# Altium project Sampler.PrjPCB (part 1 of 5)
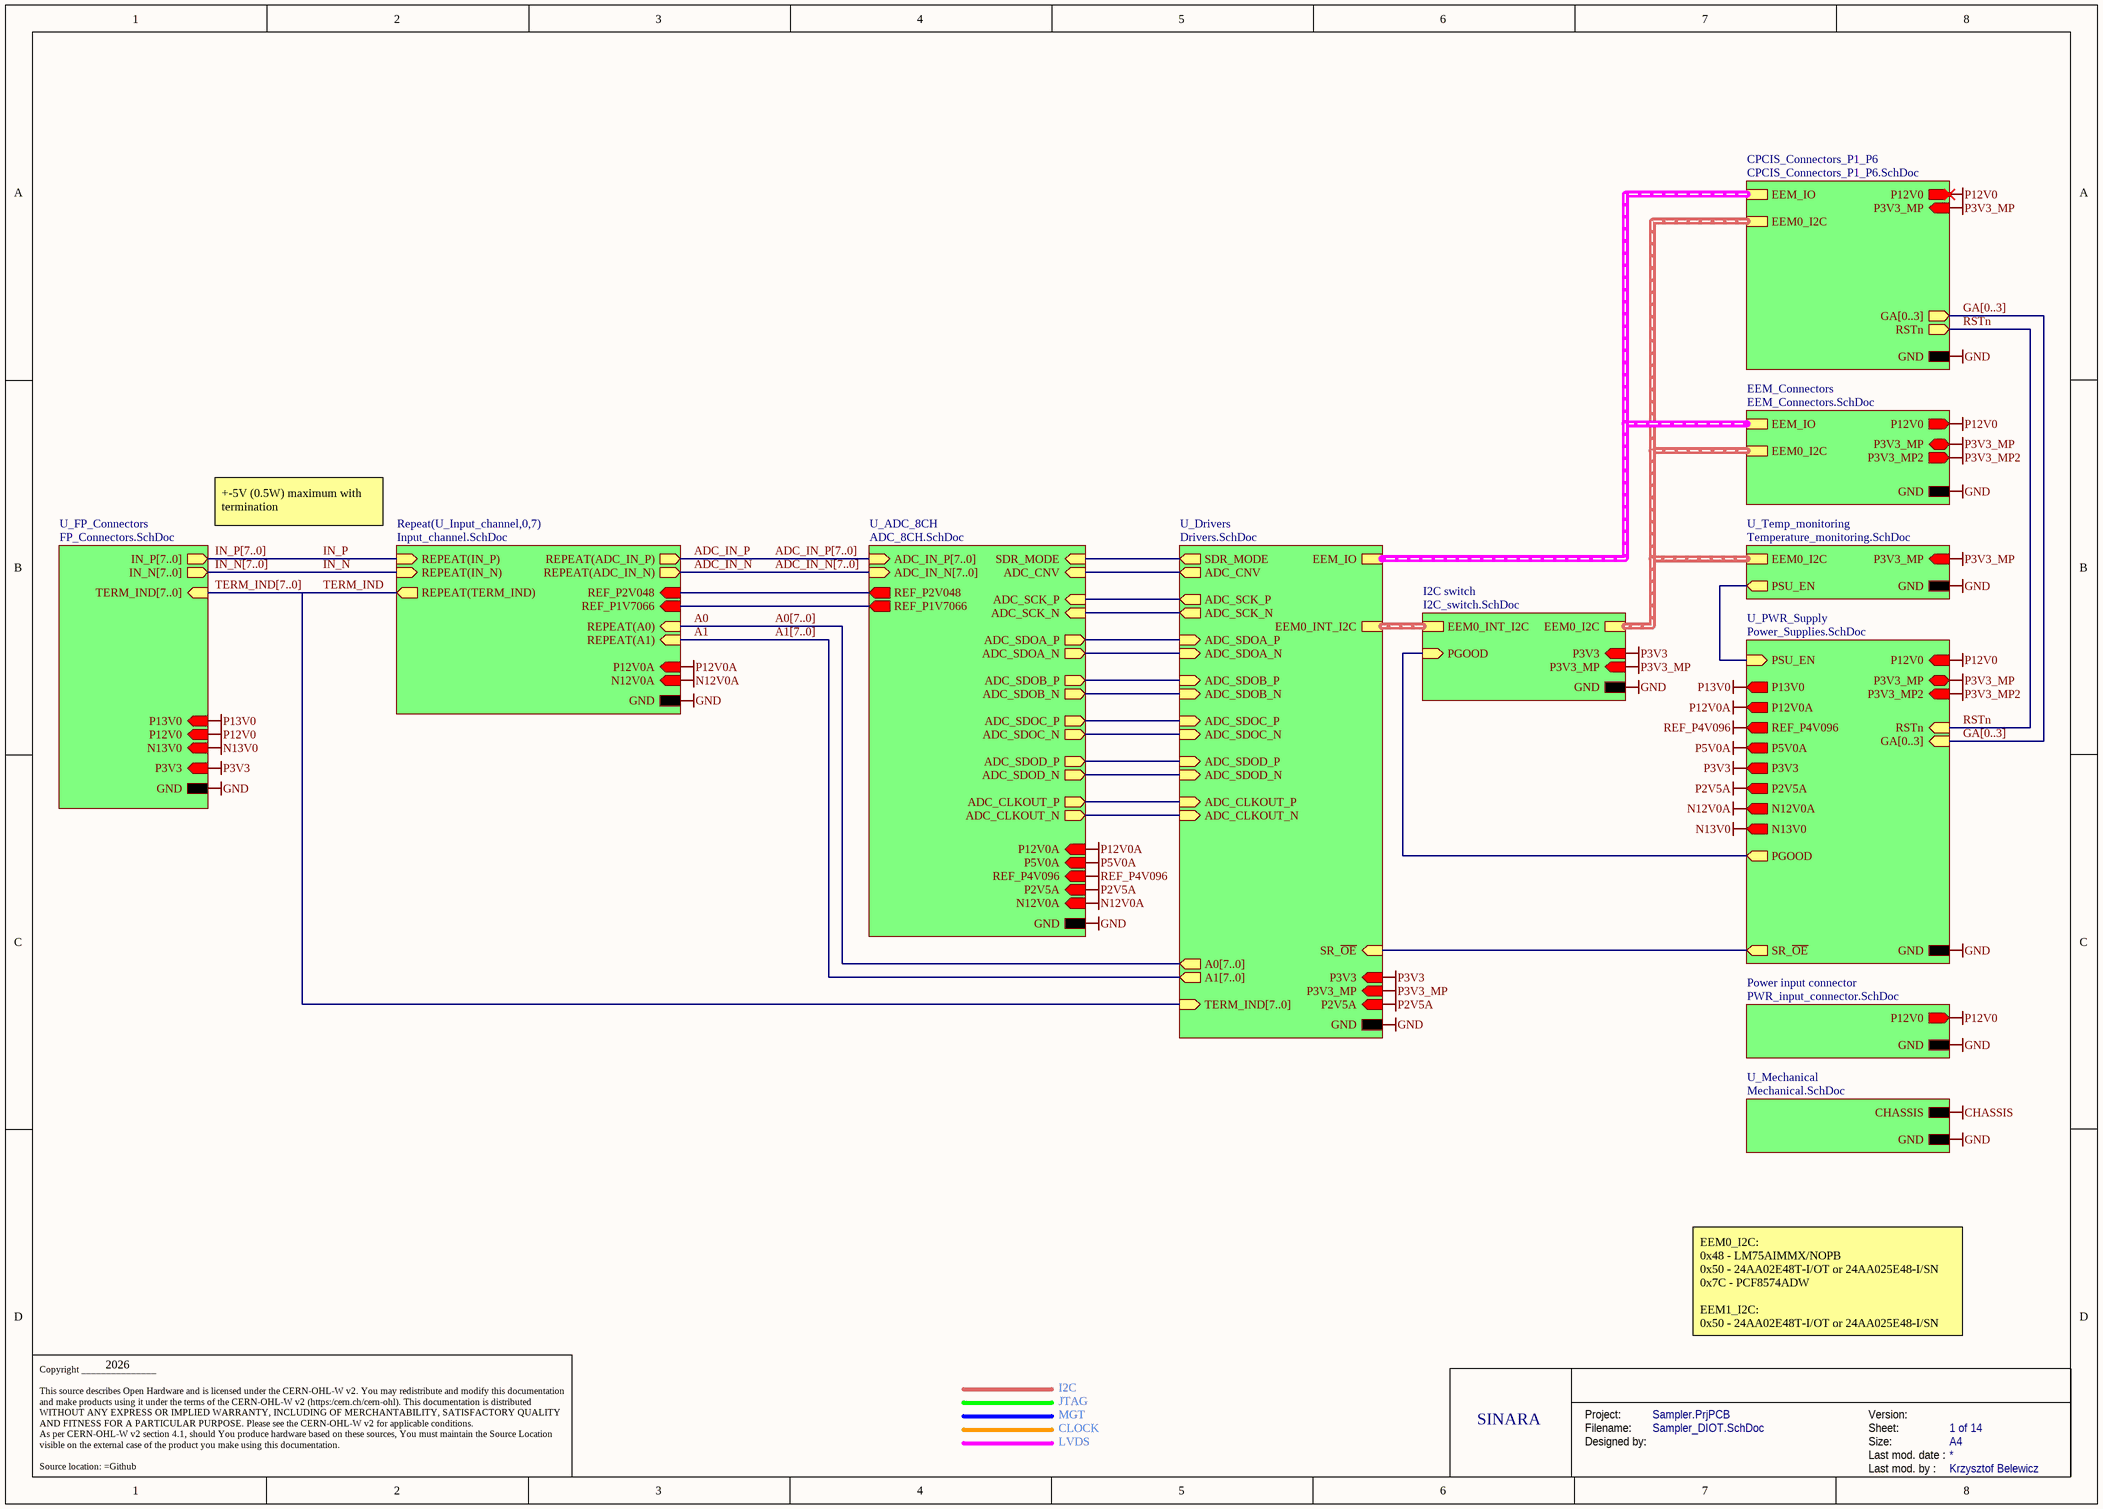
[diagram p0: Sampler_DIOT.SchDoc]
P_author1: Grzegorz Kasprowicz; P_author2: Łukasz Pająk; P_author3: Krzysztof Belewicz; P_github_link: https://github.com/sinara-hw/Sampler; P_version: 2.3.1
15 sheets, 709 parts. Net scope: strictly hierarchical (ports join the sheet entries above them; power ports are local).
Board files: Sampler_DIOT.PCBDOC, DIOT_Sampler_Adapter.PCBDOC
Sheets:
  Sampler_DIOT.SchDoc
    U_PWR_Supply = Power_Supplies.SchDoc
      U_Power-up_delay = Power-up_delay.SchDoc
      U_Power_main_DCDC = Power_main_DCDC.SchDoc
    CPCIS_Connectors_P1_P6 = CPCIS_Connectors_P1_P6.SchDoc
      U_DIOT_signal_routing = DIOT_signal_routing.SchDoc
    EEM_Connectors = EEM_Connectors.SchDoc
    U_Temp_monitoring = Temperature_monitoring.SchDoc
    U_Mechanical = Mechanical.SchDoc
    U_FP_Connectors = FP_Connectors.SchDoc
    U_ADC_8CH = ADC_8CH.SchDoc
    U_Input_channel0 = Input_channel.SchDoc
    U_Input_channel1 = Input_channel.SchDoc
    U_Input_channel2 = Input_channel.SchDoc
    U_Input_channel3 = Input_channel.SchDoc
    U_Input_channel4 = Input_channel.SchDoc
    U_Input_channel5 = Input_channel.SchDoc
    U_Input_channel6 = Input_channel.SchDoc
    U_Input_channel7 = Input_channel.SchDoc
    U_Drivers = Drivers.SchDoc
    I2C switch = I2C_switch.SchDoc
    Power input connector = PWR_input_connector.SchDoc

## Sheet Sampler_DIOT.SchDoc: =DocumentName
size A3; DocumentNumber: 1; Revision: 0; SheetNumber: 1; SheetTotal: 14; Version: 2.3.1; Author 1: Grzegorz Kasprowicz; Author 2: Łukasz Pająk; Author 3: Krzysztof Belewicz; Github: https://github.com/sinara-hw/Sampler; Last modified by: Krzysztof Belewicz

### Sub-sheets
CPCIS_Connectors_P1_P6 = CPCIS_Connectors_P1_P6.SchDoc: P12V0 (out), P3V3_MP (in), EEM_IO (harness EEM_LVDS), EEM0_I2C (harness I2C), GA[0..3] (out), GND, RSTn (out)
EEM_Connectors = EEM_Connectors.SchDoc: P3V3_MP (bidir), P12V0 (out), EEM_IO (harness EEM_LVDS), EEM0_I2C (harness I2C), GND, P3V3_MP2 (out)
I2C switch = I2C_switch.SchDoc: PGOOD (in), EEM0_I2C (harness I2C), EEM0_INT_I2C (harness I2C), GND, P3V3 (in), P3V3_MP (in)
Power input connector = PWR_input_connector.SchDoc: P12V0 (out), GND
Repeat(U_Input_channel,0,7) = Input_channel.SchDoc: REPEAT(IN_N) (in), REPEAT(A0) (in), REPEAT(A1) (in), REPEAT(IN_P) (in), REPEAT(TERM_IND) (out), REPEAT(ADC_IN_N) (out), REPEAT(ADC_IN_P) (out), REF_P2V048 (in), REF_P1V7066 (in), GND, N12V0A (in), P12V0A (in)
U_ADC_8CH = ADC_8CH.SchDoc: ADC_IN_P[7..0] (in), ADC_IN_N[7..0] (in), ADC_SDOA_P (out), ADC_SDOA_N (out), ADC_SCK_P (in), ADC_SCK_N (in), ADC_CNV (in), ADC_SDOB_N (out), ADC_SDOB_P (out), ADC_SDOC_P (out), ADC_SDOC_N (out), ADC_SDOD_N (out), ADC_SDOD_P (out), ADC_CLKOUT_P (out), ADC_CLKOUT_N (out), SDR_MODE (in), REF_P2V048 (out), REF_P1V7066 (out), GND, P2V5A (in), P5V0A (in), REF_P4V096 (in), P12V0A (in), N12V0A (in)
U_Drivers = Drivers.SchDoc: EEM0_INT_I2C (harness I2C), EEM_IO (harness EEM_LVDS), SR_~{OE} (in), A0[7..0] (out), ADC_SCK_P (out), TERM_IND[7..0] (in), ADC_SDOA_N (in), ADC_CLKOUT_N (in), ADC_SCK_N (out), ADC_SDOA_P (in), A1[7..0] (out), ADC_SDOB_P (in), ADC_SDOD_N (in), ADC_CNV (out), ADC_SDOD_P (in), ADC_SDOC_P (in), ADC_SDOC_N (in), ADC_SDOB_N (in), ADC_CLKOUT_P (in), SDR_MODE (out), GND, P3V3 (in), P2V5A (in), P3V3_MP (in)
U_FP_Connectors = FP_Connectors.SchDoc: GND, P3V3 (in), IN_P[7..0] (out), IN_N[7..0] (out), TERM_IND[7..0] (in), N13V0 (in), P12V0 (in), P13V0 (in)
U_Mechanical = Mechanical.SchDoc: CHASSIS, GND
U_PWR_Supply = Power_Supplies.SchDoc: GND, P12V0 (in), P3V3_MP (bidir), PGOOD (out), GA[0..3] (in), RSTn (in), PSU_EN (in), P3V3_MP2 (in), SR_~{OE} (out), P13V0 (out), P12V0A (out), REF_P4V096 (out), P5V0A (out), P3V3 (out), P2V5A (out), N12V0A (out), N13V0 (out)
U_Temp_monitoring = Temperature_monitoring.SchDoc: GND, P3V3_MP (in), EEM0_I2C (harness I2C), PSU_EN (out)

### Nets
GND: sheet U_PWR_Supply/GND, sheet CPCIS_Connectors_P1_P6/GND, sheet EEM_Connectors/GND, sheet U_Temp_monitoring/GND, sheet U_Mechanical/GND, sheet U_FP_Connectors/GND, sheet U_ADC_8CH/GND, sheet Repeat(U_Input_channel,0,7)/GND, sheet U_Drivers/GND, sheet I2C switch/GND, sheet Power input connector/GND
N12V0A: sheet U_PWR_Supply/N12V0A, sheet U_ADC_8CH/N12V0A, sheet Repeat(U_Input_channel,0,7)/N12V0A
N13V0: sheet U_PWR_Supply/N13V0, sheet U_FP_Connectors/N13V0
P2V5A: sheet U_PWR_Supply/P2V5A, sheet U_ADC_8CH/P2V5A, sheet U_Drivers/P2V5A
P3V3: sheet U_PWR_Supply/P3V3, sheet U_FP_Connectors/P3V3, sheet U_Drivers/P3V3, sheet I2C switch/P3V3
P3V3_MP: sheet U_PWR_Supply/P3V3_MP, sheet CPCIS_Connectors_P1_P6/P3V3_MP, sheet EEM_Connectors/P3V3_MP, sheet U_Temp_monitoring/P3V3_MP, sheet U_Drivers/P3V3_MP, sheet I2C switch/P3V3_MP
P3V3_MP2: sheet U_PWR_Supply/P3V3_MP2, sheet EEM_Connectors/P3V3_MP2
P5V0A: sheet U_PWR_Supply/P5V0A, sheet U_ADC_8CH/P5V0A
P12V0: sheet U_PWR_Supply/P12V0, sheet CPCIS_Connectors_P1_P6/P12V0, sheet EEM_Connectors/P12V0, sheet U_FP_Connectors/P12V0, sheet Power input connector/P12V0
P12V0A: sheet U_PWR_Supply/P12V0A, sheet U_ADC_8CH/P12V0A, sheet Repeat(U_Input_channel,0,7)/P12V0A
P13V0: sheet U_PWR_Supply/P13V0, sheet U_FP_Connectors/P13V0
REF_P1V7066: sheet U_ADC_8CH/REF_P1V7066, sheet Repeat(U_Input_channel,0,7)/REF_P1V7066
REF_P2V048: sheet U_ADC_8CH/REF_P2V048, sheet Repeat(U_Input_channel,0,7)/REF_P2V048
REF_P4V096: sheet U_PWR_Supply/REF_P4V096, sheet U_ADC_8CH/REF_P4V096
A0: sheet Repeat(U_Input_channel,0,7)/REPEAT(A0)
A1: sheet Repeat(U_Input_channel,0,7)/REPEAT(A1)
ADC_CLKOUT_N: sheet U_ADC_8CH/ADC_CLKOUT_N, sheet U_Drivers/ADC_CLKOUT_N
ADC_CLKOUT_P: sheet U_ADC_8CH/ADC_CLKOUT_P, sheet U_Drivers/ADC_CLKOUT_P
ADC_CNV: sheet U_ADC_8CH/ADC_CNV, sheet U_Drivers/ADC_CNV
ADC_IN_N: sheet Repeat(U_Input_channel,0,7)/REPEAT(ADC_IN_N)
ADC_IN_P: sheet Repeat(U_Input_channel,0,7)/REPEAT(ADC_IN_P)
ADC_SCK_N: sheet U_ADC_8CH/ADC_SCK_N, sheet U_Drivers/ADC_SCK_N
ADC_SCK_P: sheet U_ADC_8CH/ADC_SCK_P, sheet U_Drivers/ADC_SCK_P
ADC_SDOA_N: sheet U_ADC_8CH/ADC_SDOA_N, sheet U_Drivers/ADC_SDOA_N
ADC_SDOA_P: sheet U_ADC_8CH/ADC_SDOA_P, sheet U_Drivers/ADC_SDOA_P
ADC_SDOB_N: sheet U_ADC_8CH/ADC_SDOB_N, sheet U_Drivers/ADC_SDOB_N
ADC_SDOB_P: sheet U_ADC_8CH/ADC_SDOB_P, sheet U_Drivers/ADC_SDOB_P
ADC_SDOC_N: sheet U_ADC_8CH/ADC_SDOC_N, sheet U_Drivers/ADC_SDOC_N
ADC_SDOC_P: sheet U_ADC_8CH/ADC_SDOC_P, sheet U_Drivers/ADC_SDOC_P
ADC_SDOD_N: sheet U_ADC_8CH/ADC_SDOD_N, sheet U_Drivers/ADC_SDOD_N
ADC_SDOD_P: sheet U_ADC_8CH/ADC_SDOD_P, sheet U_Drivers/ADC_SDOD_P
IN_N: sheet Repeat(U_Input_channel,0,7)/REPEAT(IN_N)
IN_P: sheet Repeat(U_Input_channel,0,7)/REPEAT(IN_P)
PGOOD: sheet U_PWR_Supply/PGOOD, sheet I2C switch/PGOOD
PSU_EN: sheet U_PWR_Supply/PSU_EN, sheet U_Temp_monitoring/PSU_EN
RSTn: sheet U_PWR_Supply/RSTn, sheet CPCIS_Connectors_P1_P6/RSTn
SDR_MODE: sheet U_ADC_8CH/SDR_MODE, sheet U_Drivers/SDR_MODE
SR_~{OE}: sheet U_PWR_Supply/SR_~{OE}, sheet U_Drivers/SR_~{OE}
TERM_IND: sheet Repeat(U_Input_channel,0,7)/REPEAT(TERM_IND)

### Buses and harness runs
bus A0[7..0] = sheet U_Drivers/A0[7..0]
bus A1[7..0] = sheet U_Drivers/A1[7..0]
bus ADC_IN_N[7..0] = sheet U_ADC_8CH/ADC_IN_N[7..0]
bus ADC_IN_P[7..0] = sheet U_ADC_8CH/ADC_IN_P[7..0]
bus GA[0..3] = sheet CPCIS_Connectors_P1_P6/GA[0..3] = sheet U_PWR_Supply/GA[0..3]
bus IN_N[7..0] = sheet U_FP_Connectors/IN_N[7..0]
bus IN_P[7..0] = sheet U_FP_Connectors/IN_P[7..0]
bus TERM_IND[7..0] = sheet U_Drivers/TERM_IND[7..0] = sheet U_FP_Connectors/TERM_IND[7..0]
harness sheet CPCIS_Connectors_P1_P6/EEM0_I2C = sheet EEM_Connectors/EEM0_I2C = sheet I2C switch/EEM0_I2C = sheet U_Temp_monitoring/EEM0_I2C
harness sheet CPCIS_Connectors_P1_P6/EEM_IO = sheet EEM_Connectors/EEM_IO = sheet U_Drivers/EEM_IO
harness sheet I2C switch/EEM0_INT_I2C = sheet U_Drivers/EEM0_INT_I2C

### Notes on the sheet
- +-5V (0.5W) maximum with termination
- 2026
- I2C
- EEM0_I2C:
  0x48 - LM75AIMMX/NOPB
  0x50 - 24AA02E48T-I/OT or 24AA025E48-I/SN
  0x7C - PCF8574ADW
  EEM1_I2C:
  0x50 - 24AA02E48T-I/OT or 24AA025E48-I/SN
- JTAG
- MGT
- CLOCK
- LVDS
- SINARA
- Project:
- Designed by:
- Filename:
- Size:
- Version:
- Last mod. date :
- Sheet:
- A4
- Copyright _______________
  This source describes Open Hardware and is licensed under the CERN-OHL-W v2. You may redistribute and modify this documentation and make products using it under the terms of the CERN-OHL-W v2 (https:/cern.ch/cern-ohl). This documentation is distributed WITHOUT ANY EXPRESS OR IMPLIED WARRANTY, INCLUDING OF MERCHANTABILITY, SATISFACTORY QUALITY AND FITNESS FOR A PARTICULAR PURPOSE. Please see the CERN-OHL-W v2 for applicable conditions.
  As per CERN-OHL-W v2 section 4.1, should You produce hardware based on these sources, You must maintain the Source Location visible on the external case of the product you make using this documentation.
  Source location: =Github
- Last mod. by :

## Sheet Power_Supplies.SchDoc: =DocumentName
size A4; SPICEModelCache: <root> / <DocumentId>GVTSYOHF</DocumentId> / <CacheFrame Number="0"> / <Model Name="0603_155060gs75300" Kind="CKT"> / <Text>******** / .subckt 0603_155060GS75300 1 2 / D1 1 2 SMSW / .MODEL SMSW D / + IS=695.94E-6 / + N=5 / + RS=2.4677 / + IKF=16.109E-12 / + CJO=1.0000E-12 / + M=.3333 / + VJ=.75 / + BV=5 / + IBV=10.00E-6 / + TT=5.0000E-9 / .ends</Text> / </Model> / <Model Name="0603_155060rs75300" Kind="CKT"> / <Text>******** / .subckt 0603_155060RS75300 1 2 / D1 1 2 SMSW / .MODEL SMSW D / + IS=824.78E-18 / + N=2.2038 / + RS=.38595 / + IKF=240.07E-6 / + CJO=1.0000E-12 / + M=.3333 / + VJ=.75 / + BV=5 / + IBV=10.00E-6 / + TT=5.0000E-9 / .ends</Text> / </Model> / </CacheFrame> / </root>; DocumentNumber: 1; Revision: 0; SheetNumber: 3; SheetTotal: 15; Version: 2.3.1; Author 1: Grzegorz Kasprowicz; Author 2: Łukasz Pająk; Author 3: Krzysztof Belewicz; Github: https://github.com/sinara-hw/Sampler; Last modified by: Krzysztof Belewicz
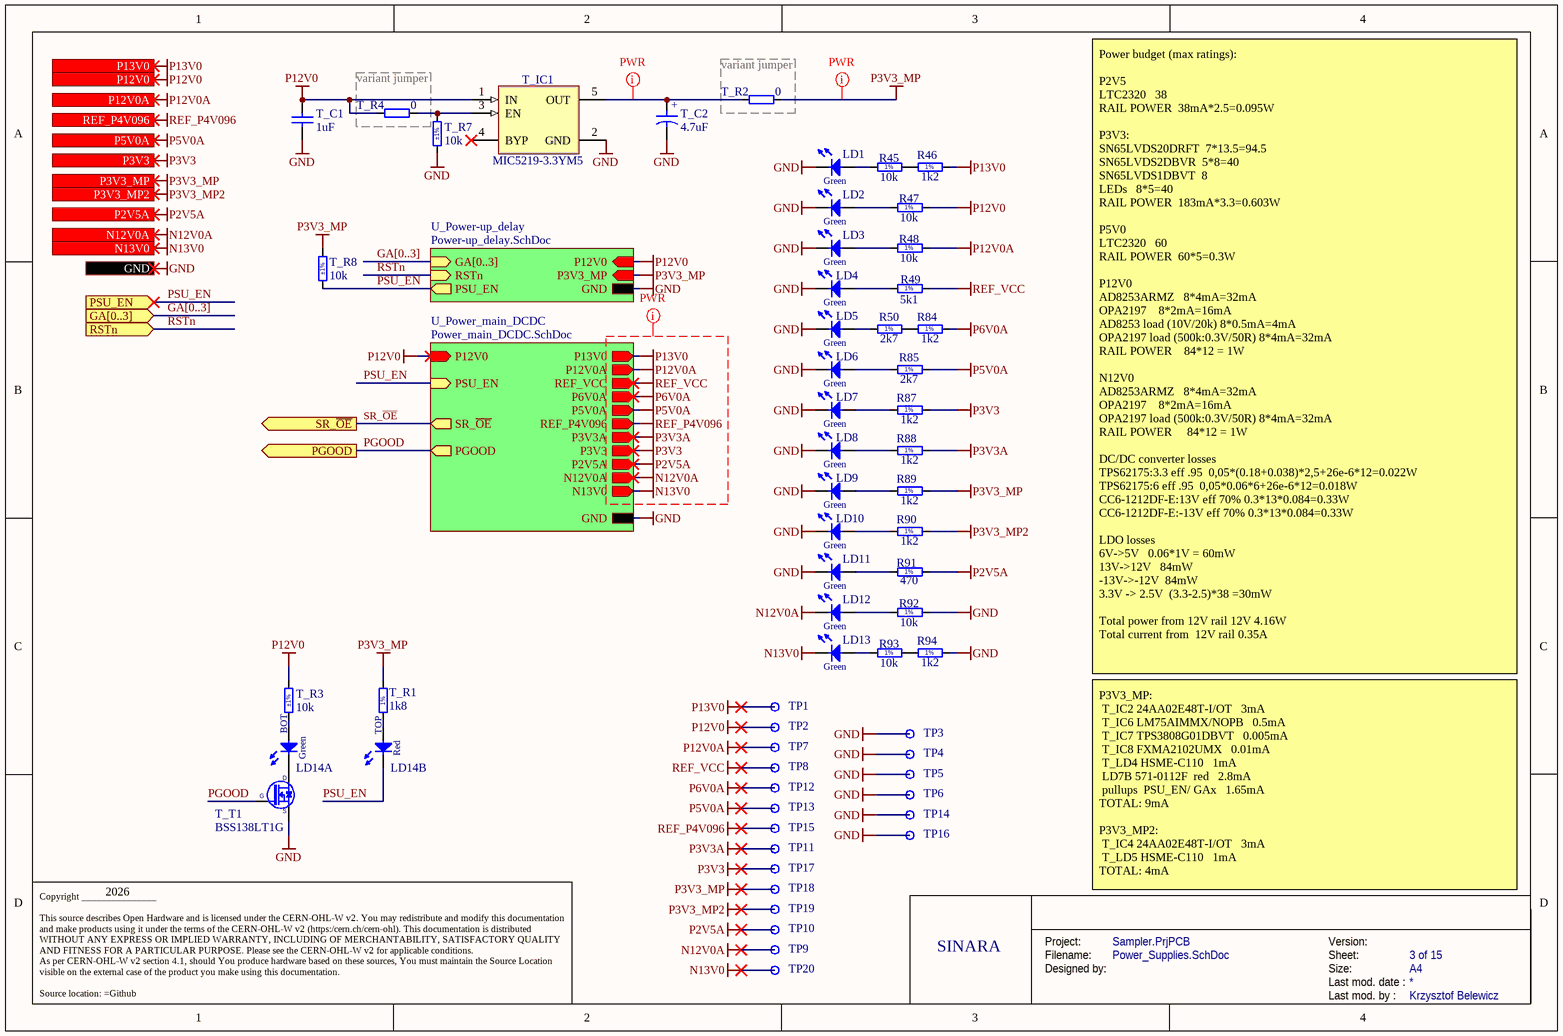
[diagram p1: Power_Supplies.SchDoc]

### Parts
LD1  Green  [LED_KINGBRIGHT_KPH-1608CGCK]
LD2  Green  [LED_KINGBRIGHT_KPH-1608CGCK]
LD3  Green  [LED_KINGBRIGHT_KPH-1608CGCK]
LD4  Green  [LED_KINGBRIGHT_KPH-1608CGCK]
LD5  Green  [LED_KINGBRIGHT_KPH-1608CGCK]
LD6  Green  [LED_KINGBRIGHT_KPH-1608CGCK]
LD7  Green  [LED_KINGBRIGHT_KPH-1608CGCK]
LD8  Green  [LED_KINGBRIGHT_KPH-1608CGCK]
LD9  Green  [LED_KINGBRIGHT_KPH-1608CGCK]
LD10  Green  [LED_KINGBRIGHT_KPH-1608CGCK]
LD11  Green  [LED_KINGBRIGHT_KPH-1608CGCK]
LD12  Green  [LED_KINGBRIGHT_KPH-1608CGCK]
LD13  Green  [LED_KINGBRIGHT_KPH-1608CGCK]
LD14  Red/Green  [LED_DIALIGHT_571-0112F]  (value not drawn)  (parts A,B of 2)
R45  10k  [RESC1005X40N]
R46  1k2  [RESC1608X55N]
R47  10k  [RESC1005X40N]
R48  10k  [RESC1005X40N]
R49  5k1  [RESC1005X40N]
R50  2k7  [RESC1608X55N]
R84  1k2  [RESC1608X55N]
R85  2k7  [RESC1608X55N]
R87  1k2  [RESC1608X55N]
R88  1k2  [RESC1608X55N]
R89  1k2  [RESC1608X55N]
R90  1k2  [RESC1608X55N]
R91  470  [RESC1005X40N]
R92  10k  [RESC1005X40N]
R93  10k  [RESC1005X40N]
R94  1k2  [RESC1608X55N]
T_C1  1uF  [CAPC1608X87N]
T_C2  4.7uF  [CAPMP3216X180N]
T_IC1  MIC5219-3.3YM5  [SOT95P280X145-5N]
T_R1  1k8  [RESC1608X55N]
T_R2  0  [RESC1005X40N]
T_R3  10k  Tolerance: ±1%  [RESC1005X40N]
T_R4  0  [RESC1005X40N]
T_R7  10k  Tolerance: ±1%  [RESC1005X40N]
T_R8  10k  Tolerance: ±1%  [RESC1005X40N]
T_T1  BSS138LT1G  [SOT95P240X110-3N]
TP1  Test Point  [TPS127]  (value not drawn)  (no BOM)
TP2  Test Point  [TPS127]  (value not drawn)  (no BOM)
TP3  Test Point  [TPS127]  (value not drawn)  (no BOM)
TP4  Test Point  [TPS127]  (value not drawn)  (no BOM)
TP5  Test Point  [TPS127]  (value not drawn)  (no BOM)
TP6  Test Point  [TPS127]  (value not drawn)  (no BOM)
TP7  Test Point  [TPS127]  (value not drawn)  (no BOM)
TP8  Test Point  [TPS127]  (value not drawn)  (no BOM)
TP9  Test Point  [TPS127]  (value not drawn)  (no BOM)
TP10  Test Point  [TPS127]  (value not drawn)  (no BOM)
TP11  Test Point  [TPS127]  (value not drawn)  (no BOM)
TP12  Test Point  [TPS127]  (value not drawn)  (no BOM)
TP13  Test Point  [TPS127]  (value not drawn)  (no BOM)
TP14  Test Point  [TPS127]  (value not drawn)  (no BOM)
TP15  Test Point  [TPS127]  (value not drawn)  (no BOM)
TP16  Test Point  [TPS127]  (value not drawn)  (no BOM)
TP17  Test Point  [TPS127]  (value not drawn)  (no BOM)
TP18  Test Point  [TPS127]  (value not drawn)  (no BOM)
TP19  Test Point  [TPS127]  (value not drawn)  (no BOM)
TP20  Test Point  [TPS127]  (value not drawn)  (no BOM)

### Blocks framed on the sheet
variant jumper: T_R4
variant jumper: T_R2

### Sub-sheets
U_Power-up_delay = Power-up_delay.SchDoc: GA[0..3] (in), RSTn (in), GND, PSU_EN (out), P3V3_MP (in), P12V0 (in)
U_Power_main_DCDC = Power_main_DCDC.SchDoc: P12V0 (in), GND, PSU_EN (in), REF_P4V096 (out), P13V0 (out), P3V3 (out), N13V0 (out), P2V5A (out), N12V0A (out), P5V0A (out), P12V0A (out), SR_~{OE} (out), P3V3A (out), P6V0A (out), REF_VCC (out), PGOOD (out)

### Ports
GA[0..3] (in), GND, N12V0A (out), N13V0 (out), P2V5A (out), P3V3 (out), P3V3_MP2 (in), P3V3_MP (in), P5V0A (out), P12V0 (in), P12V0A (out), P13V0 (out), PGOOD (out), PSU_EN (in), REF_P4V096 (out), RSTn (in), SR_~{OE} (out)

### Nets
GND: LD1.1(C) LD2.1(C) LD3.1(C) LD4.1(C) LD5.1(C) LD6.1(C) LD7.1(C) LD8.1(C) LD9.1(C) LD10.1(C) LD11.1(C) R92.2 R94.2 T_C1.1 T_C2.2 T_IC1.2(GND) T_R7.1 T_T1.2(S) TP3.1 TP4.1 TP5.1 TP6.1 TP14.1 TP16.1 ; port GND, sheet U_Power-up_delay/GND, sheet U_Power_main_DCDC/GND
N12V0A: LD12.1(C) TP9.1 ; port N12V0A, sheet U_Power_main_DCDC/N12V0A
N13V0: LD13.1(C) TP20.1 ; port N13V0, sheet U_Power_main_DCDC/N13V0
P2V5A: R91.1 TP10.1 ; port P2V5A, sheet U_Power_main_DCDC/P2V5A
P3V3: R87.2 TP17.1 ; port P3V3, sheet U_Power_main_DCDC/P3V3
P3V3_MP: R89.2 T_R1.2 T_R2.2 T_R8.2 TP18.1 ; port P3V3_MP, sheet U_Power-up_delay/P3V3_MP
P3V3_MP2: R90.2 TP19.1 ; port P3V3_MP2
P3V3A: R88.2 TP11.1 ; sheet U_Power_main_DCDC/P3V3A
P5V0A: R85.2 TP13.1 ; port P5V0A, sheet U_Power_main_DCDC/P5V0A
P6V0A: R84.2 TP12.1 ; sheet U_Power_main_DCDC/P6V0A
P12V0: R47.2 T_C1.2 T_IC1.1(IN) T_R3.2 T_R4.1 TP2.1 ; port P12V0, sheet U_Power-up_delay/P12V0, sheet U_Power_main_DCDC/P12V0
P12V0A: R48.2 TP7.1 ; port P12V0A, sheet U_Power_main_DCDC/P12V0A
P13V0: R46.2 TP1.1 ; port P13V0, sheet U_Power_main_DCDC/P13V0
REF_P4V096: TP15.1 ; port REF_P4V096, sheet U_Power_main_DCDC/REF_P4V096
REF_VCC: R49.2 TP8.1 ; sheet U_Power_main_DCDC/REF_VCC
PGOOD: T_T1.1(G) ; port PGOOD, sheet U_Power_main_DCDC/PGOOD
PSU_EN: LD14.3(C) T_R8.1 ; port PSU_EN, sheet U_Power-up_delay/PSU_EN, sheet U_Power_main_DCDC/PSU_EN
RSTn: port RSTn, sheet U_Power-up_delay/RSTn
SR_~{OE}: port SR_~{OE}, sheet U_Power_main_DCDC/SR_~{OE}
NetLD1_2: LD1.2(A) R45.1
NetLD2_2: LD2.2(A) R47.1
NetLD3_2: LD3.2(A) R48.1
NetLD4_2: LD4.2(A) R49.1
NetLD5_2: LD5.2(A) R50.1
NetLD6_2: LD6.2(A) R85.1
NetLD7_2: LD7.2(A) R87.1
NetLD8_2: LD8.2(A) R88.1
NetLD9_2: LD9.2(A) R89.1
NetLD10_2: LD10.2(A) R90.1
NetLD11_2: LD11.2(A) R91.2
NetLD12_2: LD12.2(A) R92.1
NetLD13_2: LD13.2(A) R93.1
NetLD14_1: LD14.1(C) T_T1.3(D)
NetLD14_2: LD14.2(A) T_R3.1
NetLD14_4: LD14.4(A) T_R1.1
NetR45_2: R45.2 R46.1
NetR50_2: R50.2 R84.1
NetR93_2: R93.2 R94.1
NetT_C2_1: T_C2.1 T_IC1.5(OUT) T_R2.1
NetT_IC1_3: T_IC1.3(EN) T_R4.2 T_R7.2

Not connected (* = marked no-connect by the designer): T_IC1 4(BYP)*

### Buses and harness runs
bus GA[0..3] = port GA[0..3]
bus GA[0..3] = sheet U_Power-up_delay/GA[0..3]

### Layout directives
net class PWR: N12V0A, N13V0, NetT_C2_1, P2V5A, P3V3, P3V3_MP, P3V3A, P5V0A, P6V0A, P12V0A, P13V0, REF_P4V096, REF_VCC

### Notes on the sheet
- Power budget (max ratings):
  P2V5
  LTC2320			38
  RAIL POWER		38mA*2.5=0.095W
  P3V3:
  SN65LVDS20DRFT		7*13.5=94.5
  SN65LVDS2DBVR		5*8=40
  SN65LVDS1DBVT		8
  LEDs			8*5=40
  RAIL POWER		183mA*3.3=0.603W
  P5V0
  LTC2320			60
  RAIL POWER		60*5=0.3W
  P12V0
  AD8253ARMZ 		8*4mA=32mA
  OPA2197 			8*2mA=16mA
  AD8253 load (10V/20k)	8*0.5mA=4mA
  OPA2197 load (500k:0.3V/50R)	8*4mA=32mA
  RAIL POWER 		 84*12 = 1W
  N12V0
  AD8253ARMZ 		8*4mA=32mA
  OPA2197 			8*2mA=16mA
  OPA2197 load (500k:0.3V/50R)	8*4mA=32mA
  RAIL POWER  		 84*12 = 1W
  DC/DC converter losses
  TPS62175:3.3 eff .95		0,05*(0.18+0.038)*2,5+26e-6*12=0.022W
  TPS62175:6 eff .95		0,05*0.06*6+26e-6*12=0.018W
  CC6-1212DF-E:13V eff 70%	0.3*13*0.084=0.33W
  CC6-1212DF-E:-13V eff 70%	0.3*13*0.084=0.33W
  LDO losses
  6V->5V			0.06*1V = 60mW
  13V->12V			84mW
  -13V->-12V		84mW
  3.3V -> 2.5V		(3.3-2.5)*38 =30mW
  Total power from 12V rail	12V 4.16W
  Total current from  12V rail	0.35A
- 2026
- P3V3_MP:
  T_IC2	24AA02E48T-I/OT			3mA
  T_IC6	LM75AIMMX/NOPB			0.5mA
  T_IC7	TPS3808G01DBVT			0.005mA
  T_IC8	FXMA2102UMX			0.01mA
  T_LD4	HSME-C110			1mA
  LD7B	571-0112F	 red			2.8mA
  pullups 	PSU_EN/ GAx			1.65mA
  TOTAL: 9mA
  P3V3_MP2:
  T_IC4	24AA02E48T-I/OT			3mA
  T_LD5	HSME-C110			1mA
  TOTAL: 4mA
- SINARA
- Project:
- Designed by:
- Filename:
- Size:
- Version:
- Last mod. date :
- Sheet:
- A4
- Copyright _______________
  This source describes Open Hardware and is licensed under the CERN-OHL-W v2. You may redistribute and modify this documentation and make products using it under the terms of the CERN-OHL-W v2 (https:/cern.ch/cern-ohl). This documentation is distributed WITHOUT ANY EXPRESS OR IMPLIED WARRANTY, INCLUDING OF MERCHANTABILITY, SATISFACTORY QUALITY AND FITNESS FOR A PARTICULAR PURPOSE. Please see the CERN-OHL-W v2 for applicable conditions.
  As per CERN-OHL-W v2 section 4.1, should You produce hardware based on these sources, You must maintain the Source Location visible on the external case of the product you make using this documentation.
  Source location: =Github
- Last mod. by :
- (in symbol CTE3216-18_4.7UF_10V_10%_AVX_TPSA475K010T1400) +
- (in symbol LED_DIALIGHT_571-0112F, part A) BOT; Green
- (in symbol LED_DIALIGHT_571-0112F, part B) TOP; Red
- (in symbol R0402_5K1_1%_0.0625W_100PPM) 1%
- (in symbol R0402_10K_1%_0.0625W_100PPM) 1%
- (in symbol R0402_470R_1%_0.0625W_100PPM) 1%
- (in symbol R0603_1K2_1%_0.1W_100PPM) 1%
- (in symbol R0603_1K8_1%_0.1W_100PPM) 1%
- (in symbol R0603_2K7_1%_0.1W_100PPM) 1%

### Library data of the parts
LD1-LD13 = LED_KINGBRIGHT_KPH-1608CGCK: LED Green 1C 2A; Part Description: SMD Green LED, Case 1.6mmX0.8mm(0603), 0.65mm Thickness; PressFit: No; Bonding: No; Part Number: LED_KINGBRIGHT_KPH-1608CGCK; Component Kind: Standard; Component Type: Standard; Color: Green; PackageDescription: SMT Green LED, Case 0603, Body L 1.6 x W 0.8mm H 0.65mm; Manufacturer: KINGBRIGHT; Manufacturer Part Number: KPH-1608CGCK; Pin Count: 2; Mounted: Yes; Socket: No; SMD: Yes; Sense: No; ComponentHeight: 0.65mm; HelpURL: \\cern.ch\dfs\Applications\Altium\Datasheets\LED_KINGBRIGHT_KPH-1608CGCK.pdf; Author: CERN DEM JLC; CreateDate: 03/07/2017; LatestRevisionDate: 03/07/2017
LD14 = LED_DIALIGHT_571-0112F: 2x LED  Botom Green, Top Red; Part Description: Dual 2mm  LEDs, Red Top,Green Bot, CBI® Circuit Board Indicator (Without positioning pins); PressFit: No; Bonding: No; Part Number: LED_DIALIGHT_571-0112F; Component Kind: Standard; Component Type: Standard; Color: Red/Green; PackageDescription: 2x 2mm LED (Top: Red, Bot: Green) PCB Edge Mounting (Without positioning pins) DIALIGHT 571 Serie; Manufacturer: DIALIGHT; Manufacturer Part Number: 571-0112F; Pin Count: 4; Mounted: Yes; Socket: No; SMD: No; Sense: No; ComponentHeight: 8.6mm; HelpURL: \\cern.ch\dfs\Applications\Altium\Datasheets\LED_DIALIGHT_571-0112F.pdf; Author: CERN DEM JLC; CreateDate: 09.11.2009; LatestRevisionDate: 17.03.2010
R45 R47 R48 R92 R93 T_R3 T_R7 T_R8 = R0402_10K_1%_0.0625W_100PPM: Resistor - 1%; Part Description: General Purpose Thick Film Chip Resistor; Manufacturer: GENERIC; Manufacturer1 Part Number: 232270671003L; TC: ±100ppm/°C; PressFit: No; Part Number: R0402_10K_1%_0.0625W_100PPM; Component Kind: Standard; Component Type: Standard; Pin Count: 2; Value: 10k; Status: Not Recommended; Power: 0.0625W; Manufacturer Part Number: R0402_10K_1%_0.0625W_100PPM; Case: 0402; Mounted: Yes; Sense: No; Socket: No; SMD: Yes; Manufacturer1 Example: YAGEO PHYCOMP; Manufacturer1 ComponentHeight: 0.4mm; HelpURL: \\cern.ch\dfs\Applications\Altium\Datasheets\R0402_Phycomp_RC0402.pdf; Author: CERN DEM JLC; CreateDate: 03.12.2007; LatestRevisionDate: 17.10.2012
  R45 R47 R48 R92 R93: Tolerance: ±1%
R46 R84 R87-R90 R94 = R0603_1K2_1%_0.1W_100PPM: Resistor - 1%; Part Description: General Purpose Thick Film Chip Resistor; Manufacturer: GENERIC; Manufacturer1 Part Number: NRC06F1201TRF; Power: 0.1W; TC: ±100ppm/°C; Part Number: R0603_1K2_1%_0.1W_100PPM; Component Kind: Standard; Component Type: Standard; Pin Count: 2; Value: 1k2; Status: Preferred; Tolerance: ±1%; Manufacturer Part Number: R0603_1K2_1%_0.1W_100PPM; Case: 0603; Mounted: Yes; Sense: No; Socket: No; SMD: Yes; Manufacturer1 Example: NIC COMPONENT; Manufacturer1 ComponentHeight: 0.55mm; HelpURL: \\cern.ch\dfs\Applications\Altium\Datasheets\R0603_NIC_NRC.pdf; Author: CERN DEM JLC; CreateDate: 03.12.2007; LatestRevisionDate: 13.03.2008
R49 = R0402_5K1_1%_0.0625W_100PPM: Resistor - 1%; Part Description: General Purpose Thick Film Chip Resistor; Manufacturer: GENERIC; Manufacturer1 Part Number: 232270675102L; TC: ±100ppm/°C; PressFit: No; Part Number: R0402_5K1_1%_0.0625W_100PPM; Component Kind: Standard; Component Type: Standard; Pin Count: 2; Value: 5k1; Status: Not Recommended; Power: 0.0625W; Tolerance: ±1%; Manufacturer Part Number: R0402_5K1_1%_0.0625W_100PPM; Case: 0402; Mounted: Yes; Sense: No; Socket: No; SMD: Yes; Manufacturer1 Example: YAGEO PHYCOMP; Manufacturer1 ComponentHeight: 0.4mm; HelpURL: \\cern.ch\dfs\Applications\Altium\Datasheets\R0402_Phycomp_RC0402.pdf; Author: CERN DEM JLC; CreateDate: 03.12.2007; LatestRevisionDate: 17.10.2012
R50 R85 = R0603_2K7_1%_0.1W_100PPM: Resistor - 1%; Part Description: General Purpose Thick Film Chip Resistor; Manufacturer: GENERIC; Manufacturer1 Part Number: RC0603FR-072K7L; Power: 0.1W; TC: ±100ppm/°C; Part Number: R0603_2K7_1%_0.1W_100PPM; Component Kind: Standard; Component Type: Standard; Pin Count: 2; Value: 2k7; Status: Preferred; Tolerance: ±1%; Manufacturer Part Number: R0603_2K7_1%_0.1W_100PPM; Case: 0603; Mounted: Yes; Sense: No; Socket: No; SMD: Yes; Manufacturer1 Example: YAGEO PHYCOMP; Manufacturer1 ComponentHeight: 0.55mm; HelpURL: \\cern.ch\dfs\Applications\Altium\Datasheets\R0603_PHYCOMP_RC0603.pdf; Author: CERN DEM JLC; CreateDate: 02.05.2011; LatestRevisionDate: 02.05.2011
R91 = R0402_470R_1%_0.0625W_100PPM: Resistor - 1%; Part Description: General Purpose Thick Film Chip Resistor; Manufacturer: GENERIC; Manufacturer1 Part Number: 232270674701L; TC: ±100ppm/°C; PressFit: No; Part Number: R0402_470R_1%_0.0625W_100PPM; Component Kind: Standard; Component Type: Standard; Pin Count: 2; Value: 470; Status: Not Recommended; Power: 0.0625W; Tolerance: ±1%; Manufacturer Part Number: R0402_470R_1%_0.0625W_100PPM; Case: 0402; Mounted: Yes; Sense: No; Socket: No; SMD: Yes; Manufacturer1 Example: YAGEO PHYCOMP; Manufacturer1 ComponentHeight: 0.4mm; HelpURL: \\cern.ch\dfs\Applications\Altium\Datasheets\R0402_Phycomp_RC0402.pdf; Author: CERN DEM JLC; CreateDate: 03.12.2007; LatestRevisionDate: 17.10.2012
T_C1 = CC0603_1UF_25V_10%_X7R: Non-polarised capacitor; Part Description: SMD Multilayer Chip Ceramic Capacitor; Manufacturer: GENERIC; Manufacturer1 Part Number: GRM188R71E105KA12D; Voltage: 25V; TC: X7R; Tolerance: ±10%; Part Number: CC0603_1UF_25V_10%_X7R; Component Kind: Standard; Component Type: Standard; Pin Count: 2; Value: 1uF; Status: None; Manufacturer Part Number: CC0603_1UF_25V_10%_X7R; Case: 0603; Mounted: Yes; Socket: No; SMD: Yes; Sense: No; Manufacturer1 Example: MURATA; Manufacturer1 ComponentHeight: 0.9mm; HelpURL: \\cern.ch\dfs\Applications\Altium\Datasheets\CC0603_X7R_MURATA.pdf; Author: CERN DEM JLC; CreateDate: 18.01.2011; LatestRevisionDate: 18.01.2011
T_C2 = CTE3216-18_4.7UF_10V_10%_AVX_TPSA475K010T1400: Polarised capacitor; Part Description: Low ESR 1R4 Automotive Solid Tantalum Chip Capacitor; Manufacturer: AVX; Voltage: 10V; Tolerance: ±10%; Part Number: CTE3216-18_4.7UF_10V_10%_AVX_TPSA475K010T1400; Component Kind: Standard; Component Type: Standard; Pin Count: 2; Value: 4.7uF; Status: Preferred; Manufacturer Part Number: TPSA475K010T1400; Case: A; Mounted: Yes; Socket: No; SMD: Yes; Sense: No; ComponentHeight: 1.8mm; HelpURL: \\cern.ch\dfs\Applications\Altium\Datasheets\CTE-LESR_AVX_TPS-AUTO.pdf; Author: CERN DEM JLC; CreateDate: 23.01.2018; LatestRevisionDate: 23.01.2018
T_IC1 = MIC5219-3.3YM5: 500mA Peak Output LDO Regulator; Part Description: 3.3V 500mA Peak Output Low Drop-Out  (LDO) Regulator; Manufacturer: MICROCHIP TECHNOLOGY; PressFit: No; Bonding: No; Part Number: MIC5219-3.3YM5; Component Kind: Standard; Component Type: Standard; Device: MIC5219-3.3YM5; PackageDescription: SOT, 0.95mm pitch; 5 pin, 1.60mm W X 2.90mm L X 1.45mm H body, IPC Medium Density; Manufacturer Part Number: MIC5219-3.3YM5; Pin Count: 5; Case: SOT23-5; Mounted: Yes; Socket: No; SMD: Yes; Sense: No; ComponentHeight: 1.45mm; HelpURL: \\cern.ch\dfs\Applications\Altium\Datasheets\MIC5219-3.3YM5.pdf; Author: CERN DEM WB; CreateDate: 2019-04-16; LatestRevisionDate: 2019-04-16
T_R1 = R0603_1K8_1%_0.1W_100PPM: Resistor - 1%; Part Description: General Purpose Thick Film Chip Resistor; Manufacturer: GENERIC; Manufacturer1 Part Number: NRC06F1801TRF; Power: 0.1W; TC: ±100ppm/°C; Part Number: R0603_1K8_1%_0.1W_100PPM; Component Kind: Standard; Component Type: Standard; Pin Count: 2; Value: 1k8; Status: Preferred; Tolerance: ±1%; Manufacturer Part Number: R0603_1K8_1%_0.1W_100PPM; Case: 0603; Mounted: Yes; Sense: No; Socket: No; SMD: Yes; Manufacturer1 Example: NIC COMPONENT; Manufacturer1 ComponentHeight: 0.55mm; HelpURL: \\cern.ch\dfs\Applications\Altium\Datasheets\R0603_NIC_NRC.pdf; Author: CERN DEM JLC; CreateDate: 03.12.2007; LatestRevisionDate: 13.03.2008
T_R2 T_R4 = R0402_0R_JUMPER: Resistor; Part Description: 1A (0.05R Max DC Resistance) Zero Ohm Jumper; Manufacturer: GENERIC; Manufacturer1 Part Number: 232270591001L; PressFit: No; Part Number: R0402_0R_JUMPER; Component Kind: Standard; Component Type: Standard; Pin Count: 2; Value: 0; Status: Not Recommended; Manufacturer Part Number: R0402_0R_JUMPER; Case: 0402; Mounted: Yes; Sense: No; Socket: No; SMD: Yes; Manufacturer1 Example: YAGEO PHYCOMP; Manufacturer1 ComponentHeight: 0.4mm; HelpURL: \\cern.ch\dfs\Applications\Altium\Datasheets\R0402_Phycomp_RC0402.pdf; Author: CERN DEM JLC; CreateDate: 03.12.2007; LatestRevisionDate: 17.10.2012
T_T1 = BSS138LT1G: N-CHANNEL MOSFET WITH DIODE; Part Description: 50V, 200mA N-Channel Enhancement Mode Field-Effect Transistor; Manufacturer: ON SEMICONDUCTOR; PressFit: No; Bonding: No; Part Number: BSS138LT1G; Component Kind: Standard; Component Type: Standard; Device: BSS138LT1G; PackageDescription: SOT23, 0.95mm Pitch; 3 Pin, 1.40mm W X 3.00mm L X 1.10mm H body, IPC Medium Density; Manufacturer Part Number: BSS138L; Pin Count: 3; Case: SOT23-3; Mounted: Yes; Socket: No; SMD: Yes; Sense: No; ComponentHeight: 1.11mm; HelpURL: \\cern.ch\dfs\Applications\Altium\Datasheets\BSS138LT1G.pdf; Author: CERN DEM JLC; CreateDate: 23.03.2009; LatestRevisionDate: 25.05.2022
TP1-TP20 = SMD_PAD_1.27X1.27MM: Part Description: 1.27mm x 1.27mm PCB Copper Area (SMD Test Point); Mounted: No; Part Number: SMD_PAD_1.27X1.27MM; Component Type: Standard (No BOM); Pin Count: 1; Family: Test Point; Socket: No; SMD: Yes; Sense: No; Status: None; ComponentHeight: 0mm; HelpURL: Undefined; Author: CERN DEM JLC; CreateDate: 12.01.2008; LatestRevisionDate: 12.01.2008; PackageDescription: 1.27mm x 1.27mm PCB Copper Area (SMD Test Point)

## Sheet Power-up_delay.SchDoc: =DocumentName
size A4; DocumentNumber: 1; Revision: 0; SheetNumber: 4; SheetTotal: 15; Version: 2.3.1; Author 1: Grzegorz Kasprowicz; Author 2: Łukasz Pająk; Author 3: Krzysztof Belewicz; Github: https://github.com/sinara-hw/Sampler; Last modified by: Krzysztof Belewicz
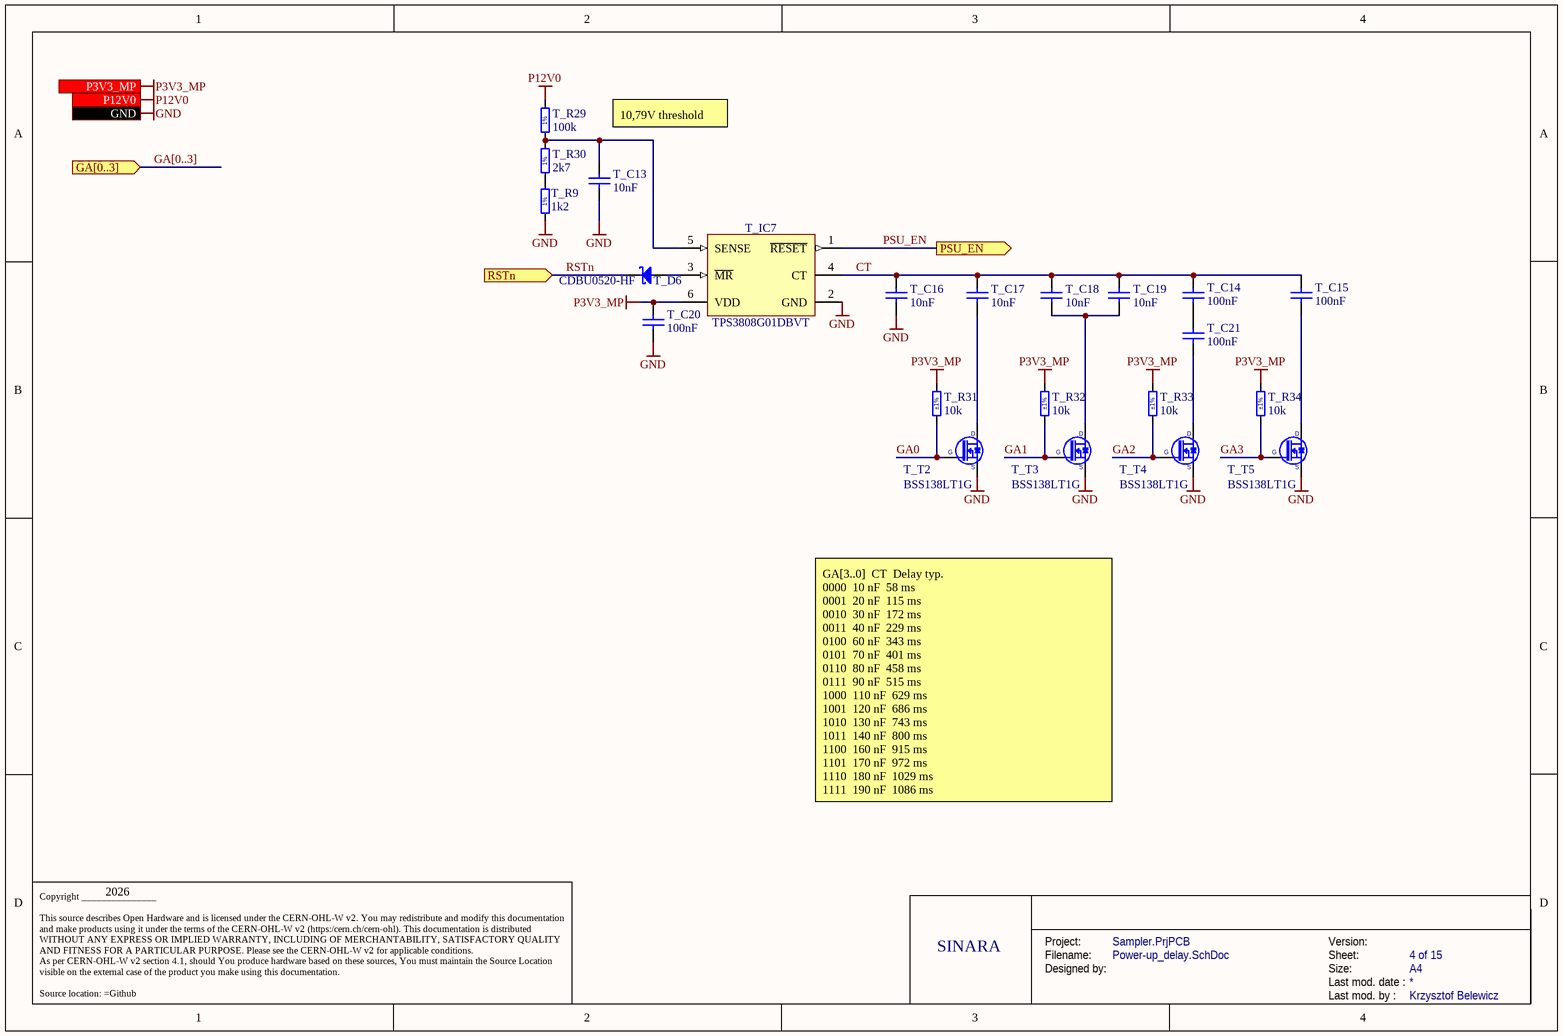
[diagram p2: Power-up_delay.SchDoc]

### Parts
T_C13  10nF  [CAPC1005X55N]
T_C14  100nF  [CAPC1005X55N]
T_C15  100nF  [CAPC1005X55N]
T_C16  10nF  [CAPC1005X55N]
T_C17  10nF  [CAPC1005X55N]
T_C18  10nF  [CAPC1005X55N]
T_C19  10nF  [CAPC1005X55N]
T_C20  100nF  [CAPC1005X55N]
T_C21  100nF  [CAPC1005X55N]
T_D6  CDBU0520-HF  [SOD-523F]
T_IC7  TPS3808G01DBVT  [SOT95P280X145-6N]
T_R9  1k2  [RESC1608X55N]
T_R29  100k  [RESC1608X55N]
T_R30  2k7  [RESC1608X55N]
T_R31  10k  Tolerance: ±1%  [RESC1005X40N]
T_R32  10k  Tolerance: ±1%  [RESC1005X40N]
T_R33  10k  Tolerance: ±1%  [RESC1005X40N]
T_R34  10k  Tolerance: ±1%  [RESC1005X40N]
T_T2  BSS138LT1G  [SOT95P240X110-3N]
T_T3  BSS138LT1G  [SOT95P240X110-3N]
T_T4  BSS138LT1G  [SOT95P240X110-3N]
T_T5  BSS138LT1G  [SOT95P240X110-3N]

### Ports
GA[0..3] (in), GND, P3V3_MP (in), P12V0 (in), PSU_EN (out), RSTn (in)

### Nets
GND: T_C13.2 T_C16.1 T_C20.1 T_IC7.2(GND) T_R9.1 T_T2.2(S) T_T3.2(S) T_T4.2(S) T_T5.2(S) ; port GND
P3V3_MP: T_C20.2 T_IC7.6(VDD) T_R31.2 T_R32.2 T_R33.2 T_R34.2 ; port P3V3_MP
P12V0: T_R29.2 ; port P12V0
CT: T_C14.2 T_C15.2 T_C16.2 T_C17.2 T_C18.2 T_C19.2 T_IC7.4(CT)
GA0: T_R31.1 T_T2.1(G)
GA1: T_R32.1 T_T3.1(G)
GA2: T_R33.1 T_T4.1(G)
GA3: T_R34.1 T_T5.1(G)
PSU_EN: T_IC7.1(~{RESET}) ; port PSU_EN
RSTn: T_D6.1(C) ; port RSTn
NetT_C13_1: T_C13.1 T_IC7.5(SENSE) T_R29.1 T_R30.2
NetT_C14_1: T_C14.1 T_C21.2
NetT_C15_1: T_C15.1 T_T5.3(D)
NetT_C17_1: T_C17.1 T_T2.3(D)
NetT_C18_1: T_C18.1 T_C19.1 T_T3.3(D)
NetT_C21_1: T_C21.1 T_T4.3(D)
NetT_D6_2: T_D6.2(A) T_IC7.3(~{MR})
NetT_R9_2: T_R9.2 T_R30.1

### Buses and harness runs
bus GA[0..3] = port GA[0..3]

### Notes on the sheet
- 10,79V threshold
- GA[3..0]		CT		Delay typ.
  0000		10 nF		58 ms
  0001		20 nF		115 ms
  0010		30 nF		172 ms
  0011		40 nF		229 ms
  0100		60 nF		343 ms
  0101		70 nF		401 ms
  0110		80 nF		458 ms
  0111		90 nF		515 ms
  1000		110 nF		629 ms
  1001		120 nF		686 ms
  1010		130 nF		743 ms
  1011		140 nF		800 ms
  1100		160 nF		915 ms
  1101		170 nF		972 ms
  1110		180 nF		1029 ms
  1111		190 nF		1086 ms
- 2026
- SINARA
- Project:
- Designed by:
- Filename:
- Size:
- Version:
- Last mod. date :
- Sheet:
- A4
- Copyright _______________
  This source describes Open Hardware and is licensed under the CERN-OHL-W v2. You may redistribute and modify this documentation and make products using it under the terms of the CERN-OHL-W v2 (https:/cern.ch/cern-ohl). This documentation is distributed WITHOUT ANY EXPRESS OR IMPLIED WARRANTY, INCLUDING OF MERCHANTABILITY, SATISFACTORY QUALITY AND FITNESS FOR A PARTICULAR PURPOSE. Please see the CERN-OHL-W v2 for applicable conditions.
  As per CERN-OHL-W v2 section 4.1, should You produce hardware based on these sources, You must maintain the Source Location visible on the external case of the product you make using this documentation.
  Source location: =Github
- Last mod. by :
- (in symbol R0603_1K2_1%_0.1W_100PPM) 1%
- (in symbol R0603_2K7_1%_0.1W_100PPM) 1%
- (in symbol R0603_100K_1%_0.1W_100PPM) 1%

### Library data of the parts
T_C13 T_C16-T_C19 = CC0402_10NF_50V_5%_X7R: Non-polarised capacitor; Part Description: SMD Multilayer Chip Ceramic Capacitor; Manufacturer: GENERIC; Manufacturer1 Part Number: C0402C103J5RAC; Voltage: 50V; TC: X7R; Tolerance: ±5%; Part Number: CC0402_10NF_50V_5%_X7R; Component Kind: Standard; Component Type: Standard; Pin Count: 2; Value: 10nF; Status: Preferred; Manufacturer Part Number: CC0402_10NF_50V_5%_X7R; Case: 0402; Mounted: Yes; Socket: No; SMD: Yes; Sense: No; Manufacturer1 Example: KEMET; Manufacturer1 ComponentHeight: 0.55mm; HelpURL: \\cern.ch\dfs\Applications\Altium\Datasheets\CC0402_X7R_KEMET.pdf; Author: CERN DEM BC; CreateDate: 15.07.2020; LatestRevisionDate: 15.07.2020
T_C14 T_C15 T_C20 T_C21 = CC0402_100NF_50V_10%_X7R: Non-polarised capacitor; Part Description: SMD Multilayer Chip Ceramic Capacitor; Manufacturer: GENERIC; Manufacturer1 Part Number: GRM155R71H104KE14D; Voltage: 50V; TC: X7R; Tolerance: ±10%; Part Number: CC0402_100NF_50V_10%_X7R; Component Kind: Standard; Component Type: Standard; Pin Count: 2; Value: 100nF; Status: None; Manufacturer Part Number: CC0402_100NF_50V_10%_X7R; Case: 0402; Mounted: Yes; Socket: No; SMD: Yes; Sense: No; Manufacturer1 Example: MURATA; Manufacturer1 ComponentHeight: 0.55mm; HelpURL: \\cern.ch\dfs\Applications\Altium\Datasheets\CC0402_MURATA_GRM155R71H104KE14D.pdf; Author: CERN DEM MR; CreateDate: 30.06.2017; LatestRevisionDate: 30.06.2017
T_D6 = CDBU0520-HF: Schottky Diode; Part Description: 20V Surface mount Schottky Barrier Diode; Manufacturer: COMCHIP; Voltage: 20V; Power: 500mA; PressFit: No; Bonding: No; Part Number: CDBU0520-HF; Component Kind: Standard; Component Type: Standard; Device: CDBU0520-HF; PackageDescription: Small Outline Diode Flat Lead (SOD-523F), Body; 1.80mm L X 1mm W X 0.85mm H; Manufacturer Part Number: CDBU0520-HF; Pin Count: 2; Case: SOD-523F; Mounted: Yes; Socket: No; SMD: Yes; Sense: No; ComponentHeight: 1mm; HelpURL: \\cern.ch\dfs\Applications\Altium\Datasheets\CDBU0520-HF.pdf; Author: CERN DEM HF; CreateDate: 13.10.2023; LatestRevisionDate: 13.10.2023
T_IC7 = TPS3808G01DBVT: Low Quiescent Current, Programmable-Delay Supervisory Circuit; Part Description: Adjustable Low Quiescent Current, Programmable-Delay Supervisory Circuit; Manufacturer: TEXAS INSTRUMENTS; PressFit: No; Bonding: No; Part Number: TPS3808G01DBVT; Component Kind: Standard; Component Type: Standard; Device: TPS3808G01DBVT; PackageDescription: SOT, 0.95mm Pitch; 6 Pin, 1.60mm W X 2.90mm L X 1.45mm H body, IPC Medium Density; Manufacturer Part Number: TPS3808G01DBV; Pin Count: 6; Case: SOT23-6; Mounted: Yes; Socket: No; SMD: Yes; Sense: No; ComponentHeight: 1.45mm; Author: CERN DEM JLC; HelpURL: \\cern.ch\dfs\Applications\Altium\Datasheets\TPS3808G01DBVT.pdf; CreateDate: 22.10.2008; LatestRevisionDate: 10.06.2022
T_R9 = R0603_1K2_1%_0.1W_100PPM: as R46 on sheet Power_Supplies; Part Number: R0603_1K2_1%_0.1W_100PPM; Component Kind: Standard; Component Type: Standard; Pin Count: 2; Value: 1k2; Status: Preferred; Tolerance: ±1%; Manufacturer Part Number: R0603_1K2_1%_0.1W_100PPM; Case: 0603; Mounted: Yes; Sense: No; Socket: No; SMD: Yes; Manufacturer1 Example: NIC COMPONENT; Manufacturer1 ComponentHeight: 0.55mm; HelpURL: \\cern.ch\dfs\Applications\Altium\Datasheets\R0603_NIC_NRC.pdf; Author: CERN DEM JLC; CreateDate: 03.12.2007; LatestRevisionDate: 13.03.2008
T_R29 = R0603_100K_1%_0.1W_100PPM: Resistor - 1%; Part Description: General Purpose Thick Film Chip Resistor; Manufacturer: GENERIC; Manufacturer1 Part Number: NRC06F1003TRF; Power: 0.1W; TC: ±100ppm/°C; Part Number: R0603_100K_1%_0.1W_100PPM; Component Kind: Standard; Component Type: Standard; Pin Count: 2; Value: 100k; Status: Preferred; Tolerance: ±1%; Manufacturer Part Number: R0603_100K_1%_0.1W_100PPM; Case: 0603; Mounted: Yes; Sense: No; Socket: No; SMD: Yes; Manufacturer1 Example: NIC COMPONENT; Manufacturer1 ComponentHeight: 0.55mm; HelpURL: \\cern.ch\dfs\Applications\Altium\Datasheets\R0603_NIC_NRC.pdf; Author: CERN DEM JLC; CreateDate: 03.12.2007; LatestRevisionDate: 13.03.2008
T_R30 = R0603_2K7_1%_0.1W_100PPM: as R50 on sheet Power_Supplies; Part Number: R0603_2K7_1%_0.1W_100PPM; Component Kind: Standard; Component Type: Standard; Pin Count: 2; Value: 2k7; Status: Preferred; Tolerance: ±1%; Manufacturer Part Number: R0603_2K7_1%_0.1W_100PPM; Case: 0603; Mounted: Yes; Sense: No; Socket: No; SMD: Yes; Manufacturer1 Example: YAGEO PHYCOMP; Manufacturer1 ComponentHeight: 0.55mm; HelpURL: \\cern.ch\dfs\Applications\Altium\Datasheets\R0603_PHYCOMP_RC0603.pdf; Author: CERN DEM JLC; CreateDate: 02.05.2011; LatestRevisionDate: 02.05.2011
T_R31-T_R34 = R0402_10K_1%_0.0625W_100PPM: as R45 on sheet Power_Supplies; Part Number: R0402_10K_1%_0.0625W_100PPM; Component Kind: Standard; Component Type: Standard; Pin Count: 2; Value: 10k; Status: Not Recommended; Power: 0.0625W; Manufacturer Part Number: R0402_10K_1%_0.0625W_100PPM; Case: 0402; Mounted: Yes; Sense: No; Socket: No; SMD: Yes; Manufacturer1 Example: YAGEO PHYCOMP; Manufacturer1 ComponentHeight: 0.4mm; HelpURL: \\cern.ch\dfs\Applications\Altium\Datasheets\R0402_Phycomp_RC0402.pdf; Author: CERN DEM JLC; CreateDate: 03.12.2007; LatestRevisionDate: 17.10.2012
T_T2-T_T5 = BSS138LT1G: as T_T1 on sheet Power_Supplies; Part Number: BSS138LT1G; Component Kind: Standard; Component Type: Standard; Device: BSS138LT1G; PackageDescription: SOT23, 0.95mm Pitch; 3 Pin, 1.40mm W X 3.00mm L X 1.10mm H body, IPC Medium Density; Manufacturer Part Number: BSS138L; Pin Count: 3; Case: SOT23-3; Mounted: Yes; Socket: No; SMD: Yes; Sense: No; ComponentHeight: 1.11mm; HelpURL: \\cern.ch\dfs\Applications\Altium\Datasheets\BSS138LT1G.pdf; Author: CERN DEM JLC; CreateDate: 23.03.2009; LatestRevisionDate: 25.05.2022